# Altium schematic sheet LLY.SchDoc
size A4
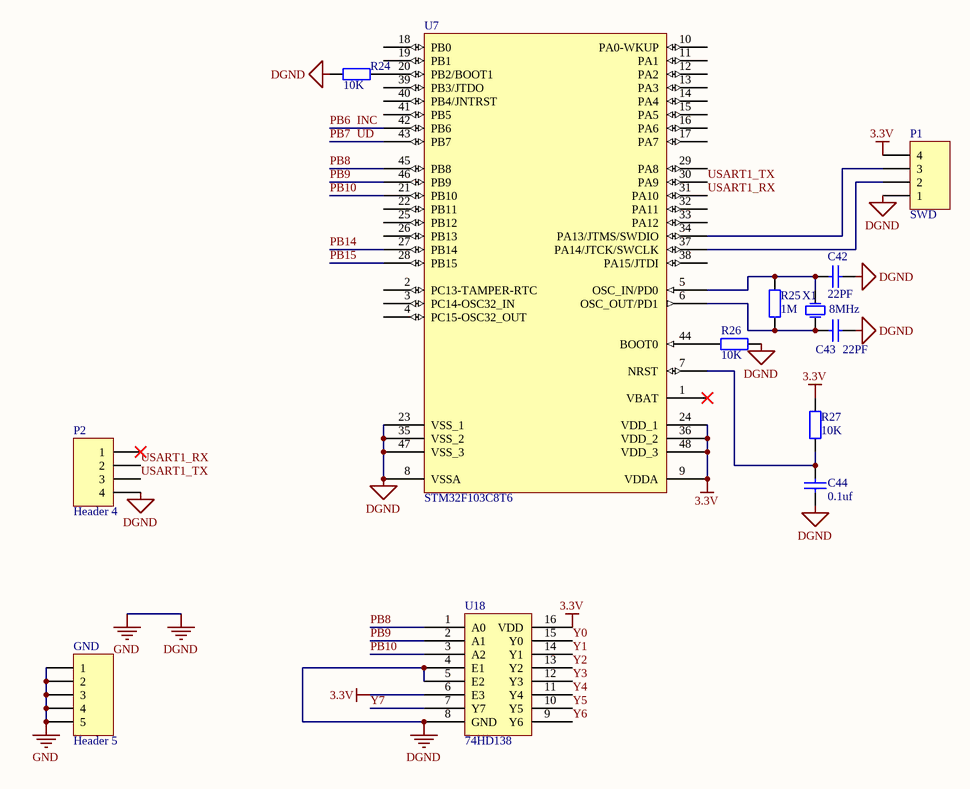
[diagram p0: LLY.SchDoc]

## Parts
C42  22PF  [0805C]
C43  22PF  [0805C]
C44  0.1uf  [0805C]
GND  Header 5  [HDR1X5]
P1  SWD  [HDR1X4]
P2  Header 4  [XH2.54W-4P]
R24  10K  [0805R]
R25  1M  [0805R]
R26  10K  [0805R]
R27  10K  [0805R]
U7  STM32F103C8T6  [LQFP48_L]
U18  74HD138  [SOP16]
X1  8MHz  [XTAL_US]

## Nets
3.3V: P1.4 R27.2 U7.9(VDDA) U7.24(VDD_1) U7.36(VDD_2) U7.48(VDD_3) U18.6(E3) U18.16(VDD)
DGND: C42.1 C43.1 C44.2 GND.1 GND.2 GND.3 GND.4 GND.5 P1.1 P2.4 R24.1 R26.2 U7.8(VSSA) U7.23(VSS_1) U7.35(VSS_2) U7.47(VSS_3) U18.4(E1) U18.5(E2) U18.8(GND)  [also labelled GND]
INC: U7.42(PB6)  [also labelled PB6]
PB7: U7.43(PB7)  [also labelled UD]
PB8: U7.45(PB8) U18.1(A0)
PB9: U7.46(PB9) U18.2(A1)
PB10: U7.21(PB10) U18.3(A2)
PB14: U7.27(PB14)
PB15: U7.28(PB15)
USART1_RX: P2.2 U7.31(PA10)
USART1_TX: P2.3 U7.30(PA9)
Y0: U18.15(Y0)
Y1: U18.14(Y1)
Y2: U18.13(Y2)
Y3: U18.12(Y3)
Y4: U18.11(Y4)
Y5: U18.10(Y5)
Y6: U18.9(Y6)
Y7: U18.7(Y7)
NetC42_2: C42.2 R25.1 U7.5(OSC_IN/PD0) X1.2(OSC2)
NetC43_2: C43.2 R25.2 U7.6(OSC_OUT/PD1) X1.1(OSC1)
NetC44_1: C44.1 R27.1 U7.7(NRST)
NetP1_2: P1.2 U7.37(PA14/JTCK/SWCLK)
NetP1_3: P1.3 U7.34(PA13/JTMS/SWDIO)
NetR24_2: R24.2 U7.20(PB2/BOOT1)
NetR26_1: R26.1 U7.44(BOOT0)

Not connected (* = marked no-connect by the designer): P2 1*; U7 1(VBAT)* 2(PC13-TAMPER-RTC) 3(PC14-OSC32_IN) 4(PC15-OSC32_OUT) 10(PA0-WKUP) 11(PA1) 12(PA2) 13(PA3) 14(PA4) 15(PA5) 16(PA6) 17(PA7) 18(PB0) 19(PB1) 22(PB11) 25(PB12) 26(PB13) 29(PA8) 32(PA11) 33(PA12) 38(PA15/JTDI) 39(PB3/JTDO) 40(PB4/JNTRST) 41(PB5)

## Library data of the parts
C42 C43 = Cap: Capacitor; Value: 0.1uF; Published: 8-Jun-2000; LatestRevisionDate: 17-Jul-2002; LatestRevisionNote: Re-released for DXP Platform.; PackageReference: RAD-0.3; Publisher: Altium Limited; PackageDescription: Radial Cap, Thru-Hole; 2 Leads; 0.3 in Pin Spacing
C44 = Cap: Capacitor; Value: 0.01uF; Published: 8-Jun-2000; LatestRevisionDate: 17-Jul-2002; LatestRevisionNote: Re-released for DXP Platform.; PackageReference: RAD-0.3; Publisher: Altium Limited; PackageDescription: Radial Cap, Thru-Hole; 2 Leads; 0.3 in Pin Spacing
GND = Header 5: Header, 5-Pin; LatestRevisionDate: 17-Jul-2002; LatestRevisionNote: Re-released for DXP Platform.; Publisher: Altium Limited
P1 = Header 4: LatestRevisionDate: 17-Jul-2002; LatestRevisionNote: Re-released for DXP Platform.; Publisher: Altium Limited
P2 = Header 4: Header, 4-Pin; LatestRevisionDate: 17-Jul-2002; LatestRevisionNote: Re-released for DXP Platform.; Publisher: Altium Limited
R24-R26 = Res2: Resistor; Published: 8-Jun-2000; LatestRevisionDate: 17-Jul-2002; LatestRevisionNote: Re-released for DXP Platform.; PackageReference: AXIAL-0.4; Publisher: Altium Limited; PackageDescription: Axial Device, Thru-Hole; 2 Leads; 0.4 in Pin Spacing
  R24 R26: Value: 10K
R27 = Res2: Resistor; Value: 1K; Published: 8-Jun-2000; LatestRevisionDate: 17-Jul-2002; LatestRevisionNote: Re-released for DXP Platform.; PackageReference: AXIAL-0.4; Publisher: Altium Limited; PackageDescription: Axial Device, Thru-Hole; 2 Leads; 0.4 in Pin Spacing
U7 = STM32F103CBT6: STM32单片机48脚; Published: 30-May-2008; DatasheetVersion: rev6, Mar-2008; PackageVersion: Mar-2008; PackageReference: LQFP48; Publisher: Altium Limited; PackageDescription: 48-Pin Low-Profile Quad Flat Pack, 7 x 7 mm Body, 0.5 mm Pitch (LQFP48); ComponentLink1Description: Manufacturer Link; ComponentLink1URL: www.st.com/stm32; ComponentLink2Description: Datasheet; ComponentLink2URL: http://www.st.com/stonline/products/literature/ds/13587.pdf
U18 = 74HD138: 74HC138
X1 = XTAL: Crystal Oscillator; Published: 8-Jun-2000; LatestRevisionDate: 17-Jul-2002; LatestRevisionNote: Re-released for DXP Platform.; Publisher: Altium Limited